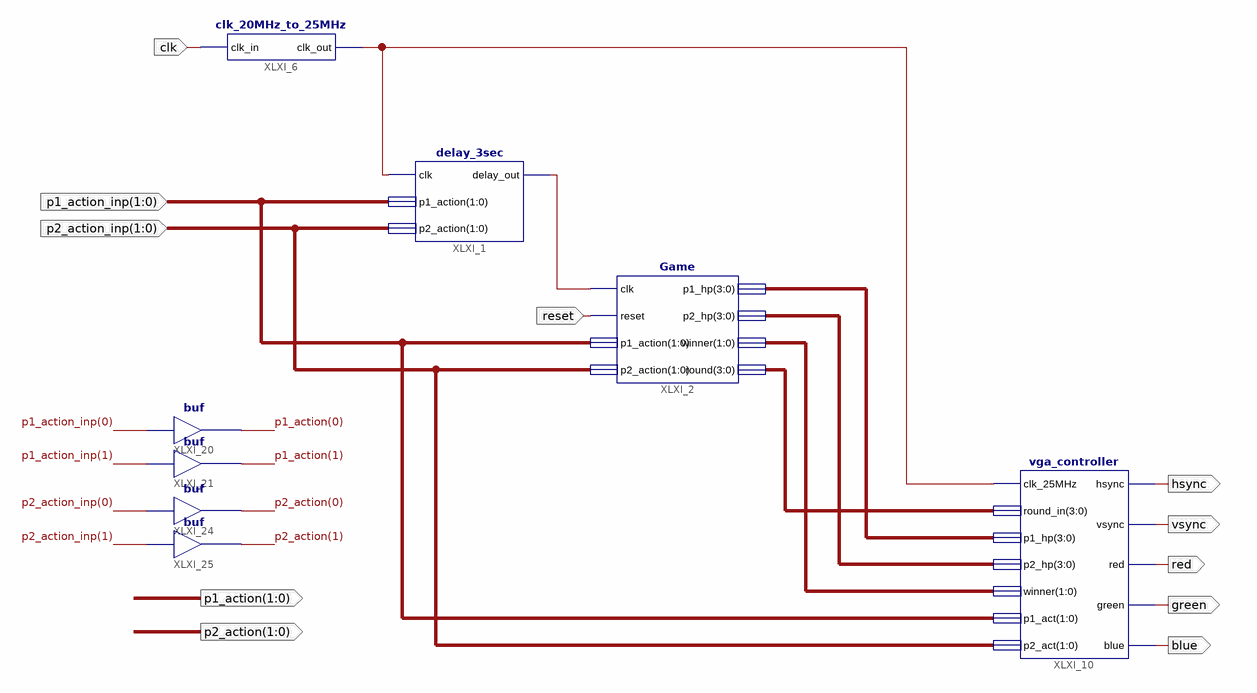
[diagram p0: schematic sheet 1]
// Xilinx ISE schematic Digital_Logic_Battle_Process.sch (spartan6) as structural Verilog: 8 symbols, 11 ports
module Digital_Logic_Battle_Process (
  input  [1:0] p1_action_inp,
  input  [1:0] p2_action_inp,
  input  reset,
  input  clk,
  output hsync,
  output vsync,
  output red,
  output green,
  output blue,
  output [1:0] p1_action,
  output [1:0] p2_action
);

  wire XLXN_1, XLXN_11;
  wire [1:0] XLXN_35;
  wire [3:0] XLXN_34, XLXN_36, XLXN_37;

  delay_3sec XLXI_1 (.clk(XLXN_11), .p1_action(p1_action_inp), .p2_action(p2_action_inp), .delay_out(XLXN_1));
  Game XLXI_2 (
    .clk(XLXN_1), .reset(reset), .p1_action(p1_action_inp), .p2_action(p2_action_inp), .p1_hp(XLXN_37),
    .p2_hp(XLXN_36), .winner(XLXN_35), .round(XLXN_34));
  clk_20MHz_to_25MHz XLXI_6 (.clk_in(clk), .clk_out(XLXN_11));
  vga_controller XLXI_10 (
    .clk_25MHz(XLXN_11), .round_in(XLXN_34), .p1_hp(XLXN_37), .p2_hp(XLXN_36), .winner(XLXN_35),
    .p1_act(p1_action_inp), .p2_act(p2_action_inp), .hsync(hsync), .vsync(vsync), .red(red), .green(green),
    .blue(blue));
  buf XLXI_20 (p1_action[0], p1_action_inp[0]);
  buf XLXI_21 (p1_action[1], p1_action_inp[1]);
  buf XLXI_24 (p2_action[0], p2_action_inp[0]);
  buf XLXI_25 (p2_action[1], p2_action_inp[1]);
endmodule
